# Altium schematic sheet bottom board.SchDoc
size A4
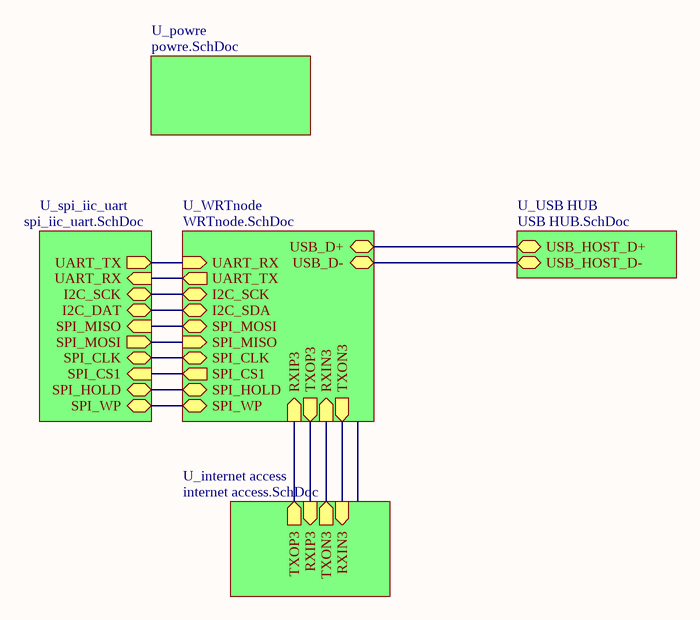
[diagram p0: bottom board.SchDoc]

## Sub-sheets
U_internet access = internet access.SchDoc: TXOP3 (out), TXON3 (out), RXIN3 (in), RXIP3 (in)
U_powre = powre.SchDoc: no entries
U_spi_iic_uart = spi_iic_uart.SchDoc: UART_TX (out), UART_RX (in), I2C_SCK (bidir), I2C_DAT (bidir), SPI_CS1 (in), SPI_MOSI (out), SPI_MISO (in), SPI_CLK (bidir), SPI_HOLD, SPI_WP
U_USB HUB = USB HUB.SchDoc: USB_HOST_D+ (bidir), USB_HOST_D- (bidir)
U_WRTnode = WRTnode.SchDoc: UART_TX (out), UART_RX (in), USB_D+ (bidir), USB_D- (bidir), I2C_SCK (bidir), I2C_SDA (bidir), SPI_MOSI (bidir), SPI_MISO (in), SPI_CLK (bidir), SPI_CS1 (out), TXON3 (out), RXIN3 (in), RXIP3 (in), TXOP3 (out), SPI_HOLD, SPI_WP

## Nets
(unnamed): sheet U_internet access/TXOP3, sheet U_WRTnode/RXIP3
(unnamed): sheet U_internet access/TXON3, sheet U_WRTnode/RXIN3
(unnamed): sheet U_internet access/RXIN3, sheet U_WRTnode/TXON3
(unnamed): sheet U_internet access/RXIP3, sheet U_WRTnode/TXOP3
(unnamed): sheet U_spi_iic_uart/UART_TX, sheet U_WRTnode/UART_RX
(unnamed): sheet U_spi_iic_uart/UART_RX, sheet U_WRTnode/UART_TX
(unnamed): sheet U_spi_iic_uart/I2C_SCK, sheet U_WRTnode/I2C_SCK
(unnamed): sheet U_spi_iic_uart/I2C_DAT, sheet U_WRTnode/I2C_SDA
(unnamed): sheet U_spi_iic_uart/SPI_CS1, sheet U_WRTnode/SPI_CS1
(unnamed): sheet U_spi_iic_uart/SPI_MOSI, sheet U_WRTnode/SPI_MISO
(unnamed): sheet U_spi_iic_uart/SPI_MISO, sheet U_WRTnode/SPI_MOSI
(unnamed): sheet U_spi_iic_uart/SPI_CLK, sheet U_WRTnode/SPI_CLK
(unnamed): sheet U_spi_iic_uart/SPI_HOLD, sheet U_WRTnode/SPI_HOLD
(unnamed): sheet U_spi_iic_uart/SPI_WP, sheet U_WRTnode/SPI_WP
(unnamed): sheet U_USB HUB/USB_HOST_D+, sheet U_WRTnode/USB_D+
(unnamed): sheet U_USB HUB/USB_HOST_D-, sheet U_WRTnode/USB_D-